# Altium project H750Common.PrjPCB
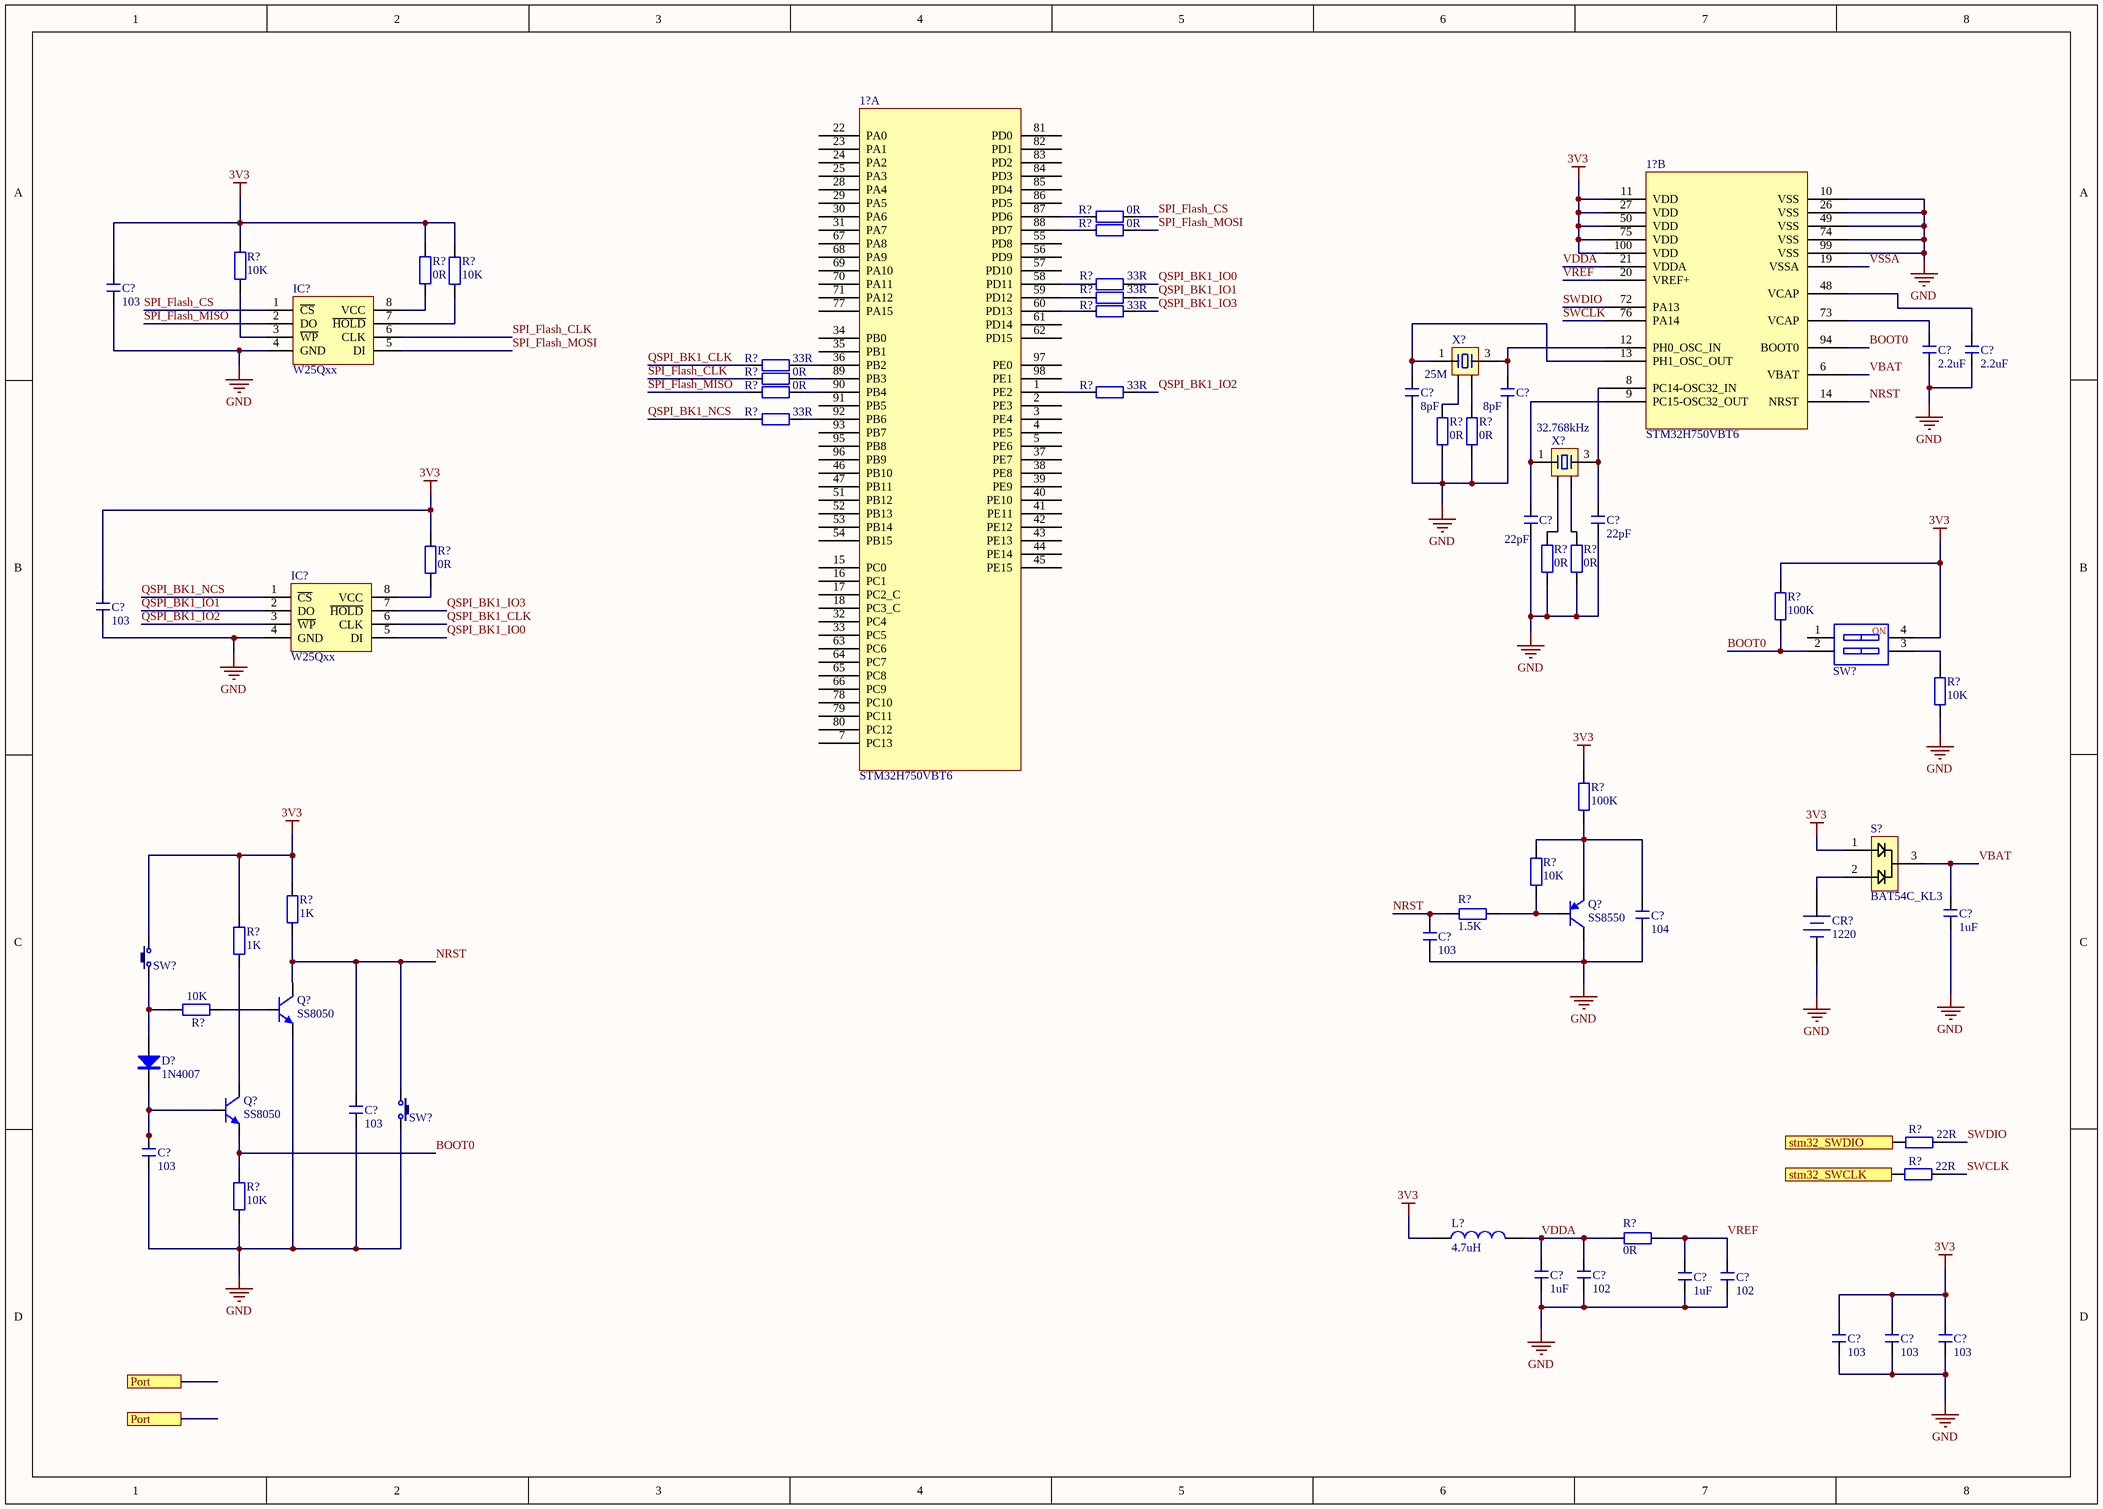
[diagram p0: H750Common2.SchDoc]
7 sheets, 143 parts. Net scope: flat (ports and power ports of the same name join across sheets).
Board file: H750Common.PcbDoc
Sheets:
  H750Common1.SchDoc
  H750Common2.SchDoc
  H750Common3.SchDoc
  H750Common4.SchDoc
  H750Common5.SchDoc
  H750Common6.SchDoc
  H750Common7.SchDoc

## Sheet H750Common1.SchDoc
size A3

## Sheet H750Common2.SchDoc
size A3

### Parts
(Parts that share a designator on the sheet are numbered #1, #2 ... from top to bottom, then left to right.)
1?#1  STM32H750VBT6  [F-QFP14x14-G100/P.5N]  (part B of 2)
1?#2  STM32H750VBT6  [F-QFP14x14-G100/P.5N]  (part A of 2)
C?#1  103  [C 0603_L]
C?#2  2.2uF  [C 0603_L]
C?#3  2.2uF  [C 0603_L]
C?#4  8pF  [C 0603_L]
C?#5  8pF  [C 0603_L]
C?#6  22pF  [C 0603_L]
C?#7  22pF  [C 0603_L]
C?#8  103  [C 0603_L]
C?#9  104  [C 0603_L]
C?#10  1uF  [C 0603_L]
C?#11  103  [C 0603_L]
C?#12  103  [C 0603_L]
C?#13  103  [C 0603_L]
C?#14  1uF  [C 0603_L]
C?#15  102  [C 0603_L]
C?#16  1uF  [C 0603_L]
C?#17  102  [C 0603_L]
C?#18  103  [C 0603_L]
C?#19  103  [C 0603_L]
C?#20  103  [C 0603_L]
CR?  1220  [CR1220_A]
D?  1N4007  [SMA]
IC?#1  W25Qxx  [SOP8W_N]
IC?#2  W25Qxx  [SOP8W_N]
L?#1  4.7uH  [L 0603]
Q?#1  SS8550  [SOT23-3N]
Q?#2  SS8050  [SOT23-3N]
Q?#3  SS8050  [SOT23-3N]
R?#1  0R  [R 0603_L]
R?#2  0R  [R 0603_L]
R?#3  10K  [R 0603_L]
R?#4  10K  [R 0603_L]
R?#5  33R  [R 0603_L]
R?#6  0R  [R 0603_L]
R?#7  33R  [R 0603_L]
R?#8  33R  [R 0603_L]
R?#9  33R  [R 0603_L]
R?#10  0R  [R 0603_L]
R?#11  0R  [R 0603_L]
R?#12  33R  [R 0603_L]
R?#13  33R  [R 0603_L]
R?#14  0R  [R 0603_L]
R?#15  0R  [R 0603_L]
R?#16  0R  [R 0603_L]
R?#17  0R  [R 0603_L]
R?#18  0R  [R 0603_L]
R?#19  100K  [R 0603_L]
R?#20  10K  [R 0603_L]
R?#21  100K  [R 0603_L]
R?#22  1K  [R 0603_L]
R?#23  10K  [R 0603_L]
R?#24  1K  [R 0603_L]
R?#25  1.5K  [R 0603_L]
R?#26  10K  [R 0603_L]
R?#27  22R  [R 0603_L]
R?#28  10K  [R 0603_L]
R?#29  22R  [R 0603_L]
R?#30  0R  [R 0603_L]
S?  BAT54C_KL3  [SO-G3/C2.25]
SW?#1  CSW-2P  [CSW1.27 SMD-2P]  (value not drawn)
SW?#2  3x6x5  [TSW SMD-3*6*2.5]  (value not drawn)
SW?#3  3x6x5  [TSW SMD-3*6*2.5]  (value not drawn)
X?#1  25M  [OSC 5032-4P]
X?#2  32.768kHz  [OSC 5032-4P]

### Ports
Port, stm32_SWCLK (in), stm32_SWDIO (in)

### Nets
3V3: 1?#1.11(VDD) 1?#1.27(VDD) 1?#1.50(VDD) 1?#1.75(VDD) 1?#1.100(VDD) C?#1.1 C?#8.1 C?#18.2 C?#19.2 C?#20.2 L?#1.1 R?#3.1 R?#4.1 R?#6.2 R?#16.2 R?#19.2 R?#21.2 R?#22.1 R?#24.1 S?.1 SW?#1.4 SW?#2.2
GND: 1?#1.10(VSS) 1?#1.26(VSS) 1?#1.49(VSS) 1?#1.74(VSS) 1?#1.99(VSS) C?#1.2 C?#2.1 C?#3.1 C?#4.1 C?#5.1 C?#6.1 C?#7.1 C?#8.2 C?#9.1 C?#10.1 C?#11.1 C?#12.1 C?#13.1 C?#14.1 C?#15.1 C?#16.1 C?#17.1 C?#18.1 C?#19.1 C?#20.1 CR?.2(DC-) IC?#1.4(GND) IC?#2.4(GND) Q?#1.3(C) Q?#2.2(E) R?#14.1 R?#15.1 R?#17.1 R?#18.1 R?#20.1 R?#28.2 SW?#3.2
BOOT0: 1?#1.94(BOOT0) Q?#3.2(E) R?#19.1 R?#28.1 SW?#1.2
NRST: 1?#1.14(NRST) C?#11.2 C?#12.2 Q?#2.3(C) R?#22.2 R?#25.2 SW?#3.1
QSPI_BK1_CLK: IC?#2.6(CLK) R?#9.2
QSPI_BK1_IO0: IC?#2.5(DI) R?#5.1
QSPI_BK1_IO1: IC?#2.2(DO) R?#7.1
QSPI_BK1_IO2: IC?#2.3(~{WP}) R?#12.1
QSPI_BK1_IO3: IC?#2.7(~{HOLD}) R?#8.1
QSPI_BK1_NCS: IC?#2.1(~{CS}) R?#13.2
SPI_Flash_CLK: IC?#1.6(CLK) R?#10.2
SPI_Flash_CS: IC?#1.1(~{CS}) R?#1.1
SPI_Flash_MISO: IC?#1.2(DO) R?#11.2
SPI_Flash_MOSI: IC?#1.5(DI) R?#2.1
SWCLK: 1?#1.76(PA14) R?#29.1
SWDIO: 1?#1.72(PA13) R?#27.1
VBAT: 1?#1.6(VBAT) C?#10.2 S?.3
VDDA: 1?#1.21(VDDA) C?#14.2 C?#15.2 L?#1.2 R?#30.1
VREF: 1?#1.20(VREF+) C?#16.2 C?#17.2 R?#30.2
VSSA: 1?#1.19(VSSA)
Net1?#1_8: 1?#1.8(PC14-OSC32_IN) C?#7.2 X?#2.3
Net1?#1_9: 1?#1.9(PC15-OSC32_OUT) C?#6.2 X?#2.1
Net1?#1_12: 1?#1.12(PH0_OSC_IN) C?#5.2 X?#1.3
Net1?#1_13: 1?#1.13(PH1_OSC_OUT) C?#4.2 X?#1.1
Net1?#1_48: 1?#1.48(VCAP) C?#3.2
Net1?#1_73: 1?#1.73(VCAP) C?#2.2
Net1?#2_1: 1?#2.1(PE2) R?#12.2
Net1?#2_36: 1?#2.36(PB2) R?#9.1
Net1?#2_58: 1?#2.58(PD11) R?#5.2
Net1?#2_59: 1?#2.59(PD12) R?#7.2
Net1?#2_60: 1?#2.60(PD13) R?#8.2
Net1?#2_87: 1?#2.87(PD6) R?#1.2
Net1?#2_88: 1?#2.88(PD7) R?#2.2
Net1?#2_89: 1?#2.89(PB3) R?#10.1
Net1?#2_90: 1?#2.90(PB4) R?#11.1
Net1?#2_92: 1?#2.92(PB6) R?#13.1
NetC?#9_2: C?#9.2 Q?#1.2(E) R?#21.1 R?#23.2
NetC?#13_2: C?#13.2 D?.2(K) Q?#3.1(B)
NetCR?_1: CR?.1(DC+) S?.2
NetD?_1: D?.1(A) R?#26.2 SW?#2.1
NetIC?#1_3: IC?#1.3(~{WP}) R?#3.2
NetIC?#1_7: IC?#1.7(~{HOLD}) R?#4.2
NetIC?#1_8: IC?#1.8(VCC) R?#6.1
NetIC?#2_8: IC?#2.8(VCC) R?#16.1
NetQ?#1_1: Q?#1.1(B) R?#23.1 R?#25.1
NetQ?#2_1: Q?#2.1(B) R?#26.1
NetQ?#3_3: Q?#3.3(C) R?#24.2
NetR?#14_2: R?#14.2 X?#1.2
NetR?#15_2: R?#15.2 X?#1.4
NetR?#17_2: R?#17.2 X?#2.2
NetR?#18_2: R?#18.2 X?#2.4
NetR?#20_2: R?#20.2 SW?#1.3
NetR?#27_2: R?#27.2 ; port stm32_SWDIO
NetR?#29_2: R?#29.2 ; port stm32_SWCLK

Not connected (* = marked no-connect by the designer): 1?#2 2(PE3) 3(PE4) 4(PE5) 5(PE6) 7(PC13) 15(PC0) 16(PC1) 17(PC2_C) 18(PC3_C) 22(PA0) 23(PA1) 24(PA2) 25(PA3) 28(PA4) 29(PA5) 30(PA6) 31(PA7) 32(PC4) 33(PC5) 34(PB0) 35(PB1) 37(PE7) 38(PE8) 39(PE9) 40(PE10) 41(PE11) 42(PE12) 43(PE13) 44(PE14) 45(PE15) 46(PB10) 47(PB11) 51(PB12) 52(PB13) 53(PB14) 54(PB15) 55(PD8) 56(PD9) 57(PD10) 61(PD14) 62(PD15) 63(PC6) 64(PC7) 65(PC8) 66(PC9) 67(PA8) 68(PA9) 69(PA10) 70(PA11) 71(PA12) 77(PA15) 78(PC10) 79(PC11) 80(PC12) 81(PD0) 82(PD1) 83(PD2) 84(PD3) 85(PD4) 86(PD5) 91(PB5) 93(PB7) 95(PB8) 96(PB9) 97(PE0) 98(PE1); SW?#1 1

### Notes on the sheet
- (in symbol CSW-2P) NO

### Library data of the parts
1?#1 1?#2 = STM32H750VB
C?#1-C?#20 = C: 无极性贴片电容; 版权归属: 源创客; BOM名称: 无极性贴片电容; 学习资源: www.ooocke.com
CR? = CR-3V: 微型电池; 版权归属: 源创客; BOM名称: 微型电池; 学习资源: www.ooocke.com
D? = 1N4007: 整流二极管; 版权归属: 源创客; BOM名称: 整流二极管; 学习资源: www.ooocke.com
IC?#1 IC?#2 = W25Qxx: 外置Flash; 版权归属: 源创客; BOM名称: 外置Flash; 学习资源: www.ooocke.com
L?#1 = L: 小功率贴片电感; 版权归属: 源创客; BOM名称: 小功率贴片电感; 学习资源: www.ooocke.com
Q?#1 = 8550-SMD: 高频放大-PNP型; 版权归属: 源创客; 属性: 40V 1.5A 1W 100MHZ; BOM名称: 高频放大-PNP型; 学习资源: www.ooocke.com
Q?#2 Q?#3 = 8050-SMD: 高频放大-NPN型; 版权归属: 源创客; 属性: 40V 1.5A 1W 100MHZ; BOM名称: 高频放大-NPN型; 学习资源: www.ooocke.com
R?#1-R?#30 = R: 贴片电阻; 版权归属: 源创客; BOM名称: 贴片电阻; 学习资源: www.ooocke.com
S? = BAT54C_KL3_1
SW?#1 = CSW-2P: 2路编码开关; 版权归属: 源创客; BOM名称: 2路编码开关; 学习资源: www.ooocke.com
SW?#2 SW?#3 = TSW 3x6: 3x6轻触开关; 版权归属: 源创客; BOM名称: 3x6轻触开关; 学习资源: www.ooocke.com
X?#1 X?#2 = XTAL-4P: 4脚无源晶振; 版权归属: 源创客; BOM名称: 4脚无源晶振; 学习资源: www.ooocke.com

## Sheet H750Common3.SchDoc
size A3
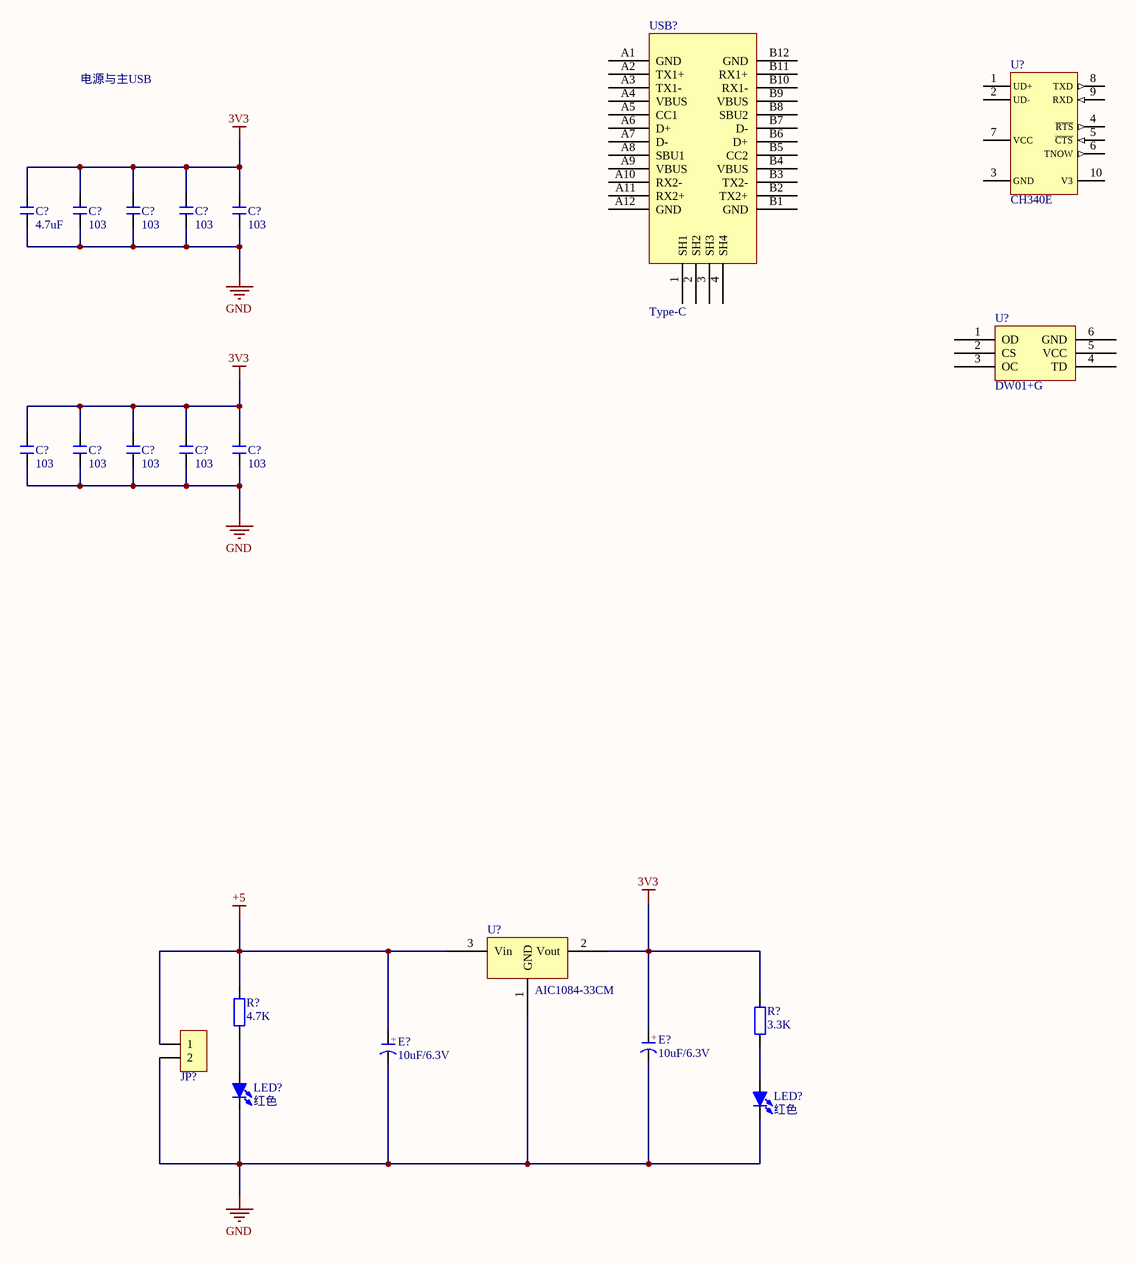
[diagram p1: H750Common3.SchDoc]

### Parts
(Parts that share a designator on the sheet are numbered #1, #2 ... from top to bottom, then left to right.)
C?#21  4.7uF  [C 0603_L]
C?#22  103  [C 0603_L]
C?#23  103  [C 0603_L]
C?#24  103  [C 0603_L]
C?#25  103  [C 0603_L]
C?#26  103  [C 0603_L]
C?#27  103  [C 0603_L]
C?#28  103  [C 0603_L]
C?#29  103  [C 0603_L]
C?#30  103  [C 0603_L]
E?#1  10uF/6.3V  [CD A(3216)]
E?#2  10uF/6.3V  [CD A(3216)]
JP?  HDR-1X2  [KF128-3.81-2P]  (value not drawn)
LED?#1  红色  [LED 0603R]
LED?#2  红色  [LED 0603B]
R?#31  4.7K  [R 0603_L]
R?#32  3.3K  [R 0603_L]
U?#1  CH340E  [MSOP-10]
U?#2  DW01+G  [SOT-23-6]
U?#3  AIC1084-33CM  [TO263-3B]
USB?#1  Type-C  [Type-C]

### Nets
3V3: C?#21.2 C?#22.2 C?#23.2 C?#24.2 C?#25.2 C?#26.2 C?#27.2 C?#28.2 C?#29.2 C?#30.2 E?#2.1(A) R?#32.1 U?#3.2(Vout)
+5: E?#1.1(A) JP?.1 R?#31.1 U?#3.3(Vin)
GND: C?#21.1 C?#22.1 C?#23.1 C?#24.1 C?#25.1 C?#26.1 C?#27.1 C?#28.1 C?#29.1 C?#30.1 E?#1.2(K) E?#2.2(K) JP?.2 LED?#1.2(K) LED?#2.2(K) U?#3.1(GND)
NetLED?#1_1: LED?#1.1(A) R?#31.2
NetLED?#2_1: LED?#2.1(A) R?#32.2

Not connected (* = marked no-connect by the designer): U?#1 1(UD+) 2(UD-) 3(GND) 4(~{RTS}) 5(~{CTS}) 6(TNOW) 7(VCC) 8(TXD) 9(RXD) 10(V3); U?#2 1(OD) 2(CS) 3(OC) 4(TD) 5(VCC) 6(GND); USB?#1 1(SH1) 2(SH2) 3(SH3) 4(SH4) A1(GND) A2(TX1+) A3(TX1-) A4(VBUS) A5(CC1) A6(D+) A7(D-) A8(SBU1) A9(VBUS) A10(RX2-) A11(RX2+) A12(GND) B1(GND) B2(TX2+) B3(TX2-) B4(VBUS) B5(CC2) B6(D+) B7(D-) B8(SBU2) B9(VBUS) B10(RX1-) B11(RX1+) B12(GND)

### Notes on the sheet
- 电源与主USB
- (in symbol C-CD) +

### Library data of the parts
C?#21-C?#30 = C: 无极性贴片电容; 版权归属: 源创客; BOM名称: 无极性贴片电容; 学习资源: www.ooocke.com
E?#1 E?#2 = C-CD: 贴片钽电容; 版权归属: 源创客; BOM名称: 贴片钽电容; 学习资源: www.ooocke.com
JP? = Header 2: 2P接插件; 版权归属: 源创客; BOM名称: 2P接插件; 学习资源: www.ooocke.com
LED?#1 LED?#2 = LED-SMD: 贴片LED; 版权归属: 源创客; BOM名称: 贴片LED; 学习资源: www.ooocke.com
R?#31 R?#32 = R: 贴片电阻; 版权归属: 源创客; BOM名称: 贴片电阻; 学习资源: www.ooocke.com
U?#1 = CH340E: USB 转 串口
U?#2 = DW01+G_[C14213]: 电池保护芯片; ComponentLink1Description: 供应商链接; ComponentLink1URL: http://www.szlcsc.com/product/details_14870.html; Package: SOT-23-6; Supplier: LC; SuppliersPartNumber: C14213
U?#3 = AIC1084-33CM: pin to pad: 1>G 2>D 3>S

## Sheet H750Common4.SchDoc
size A3
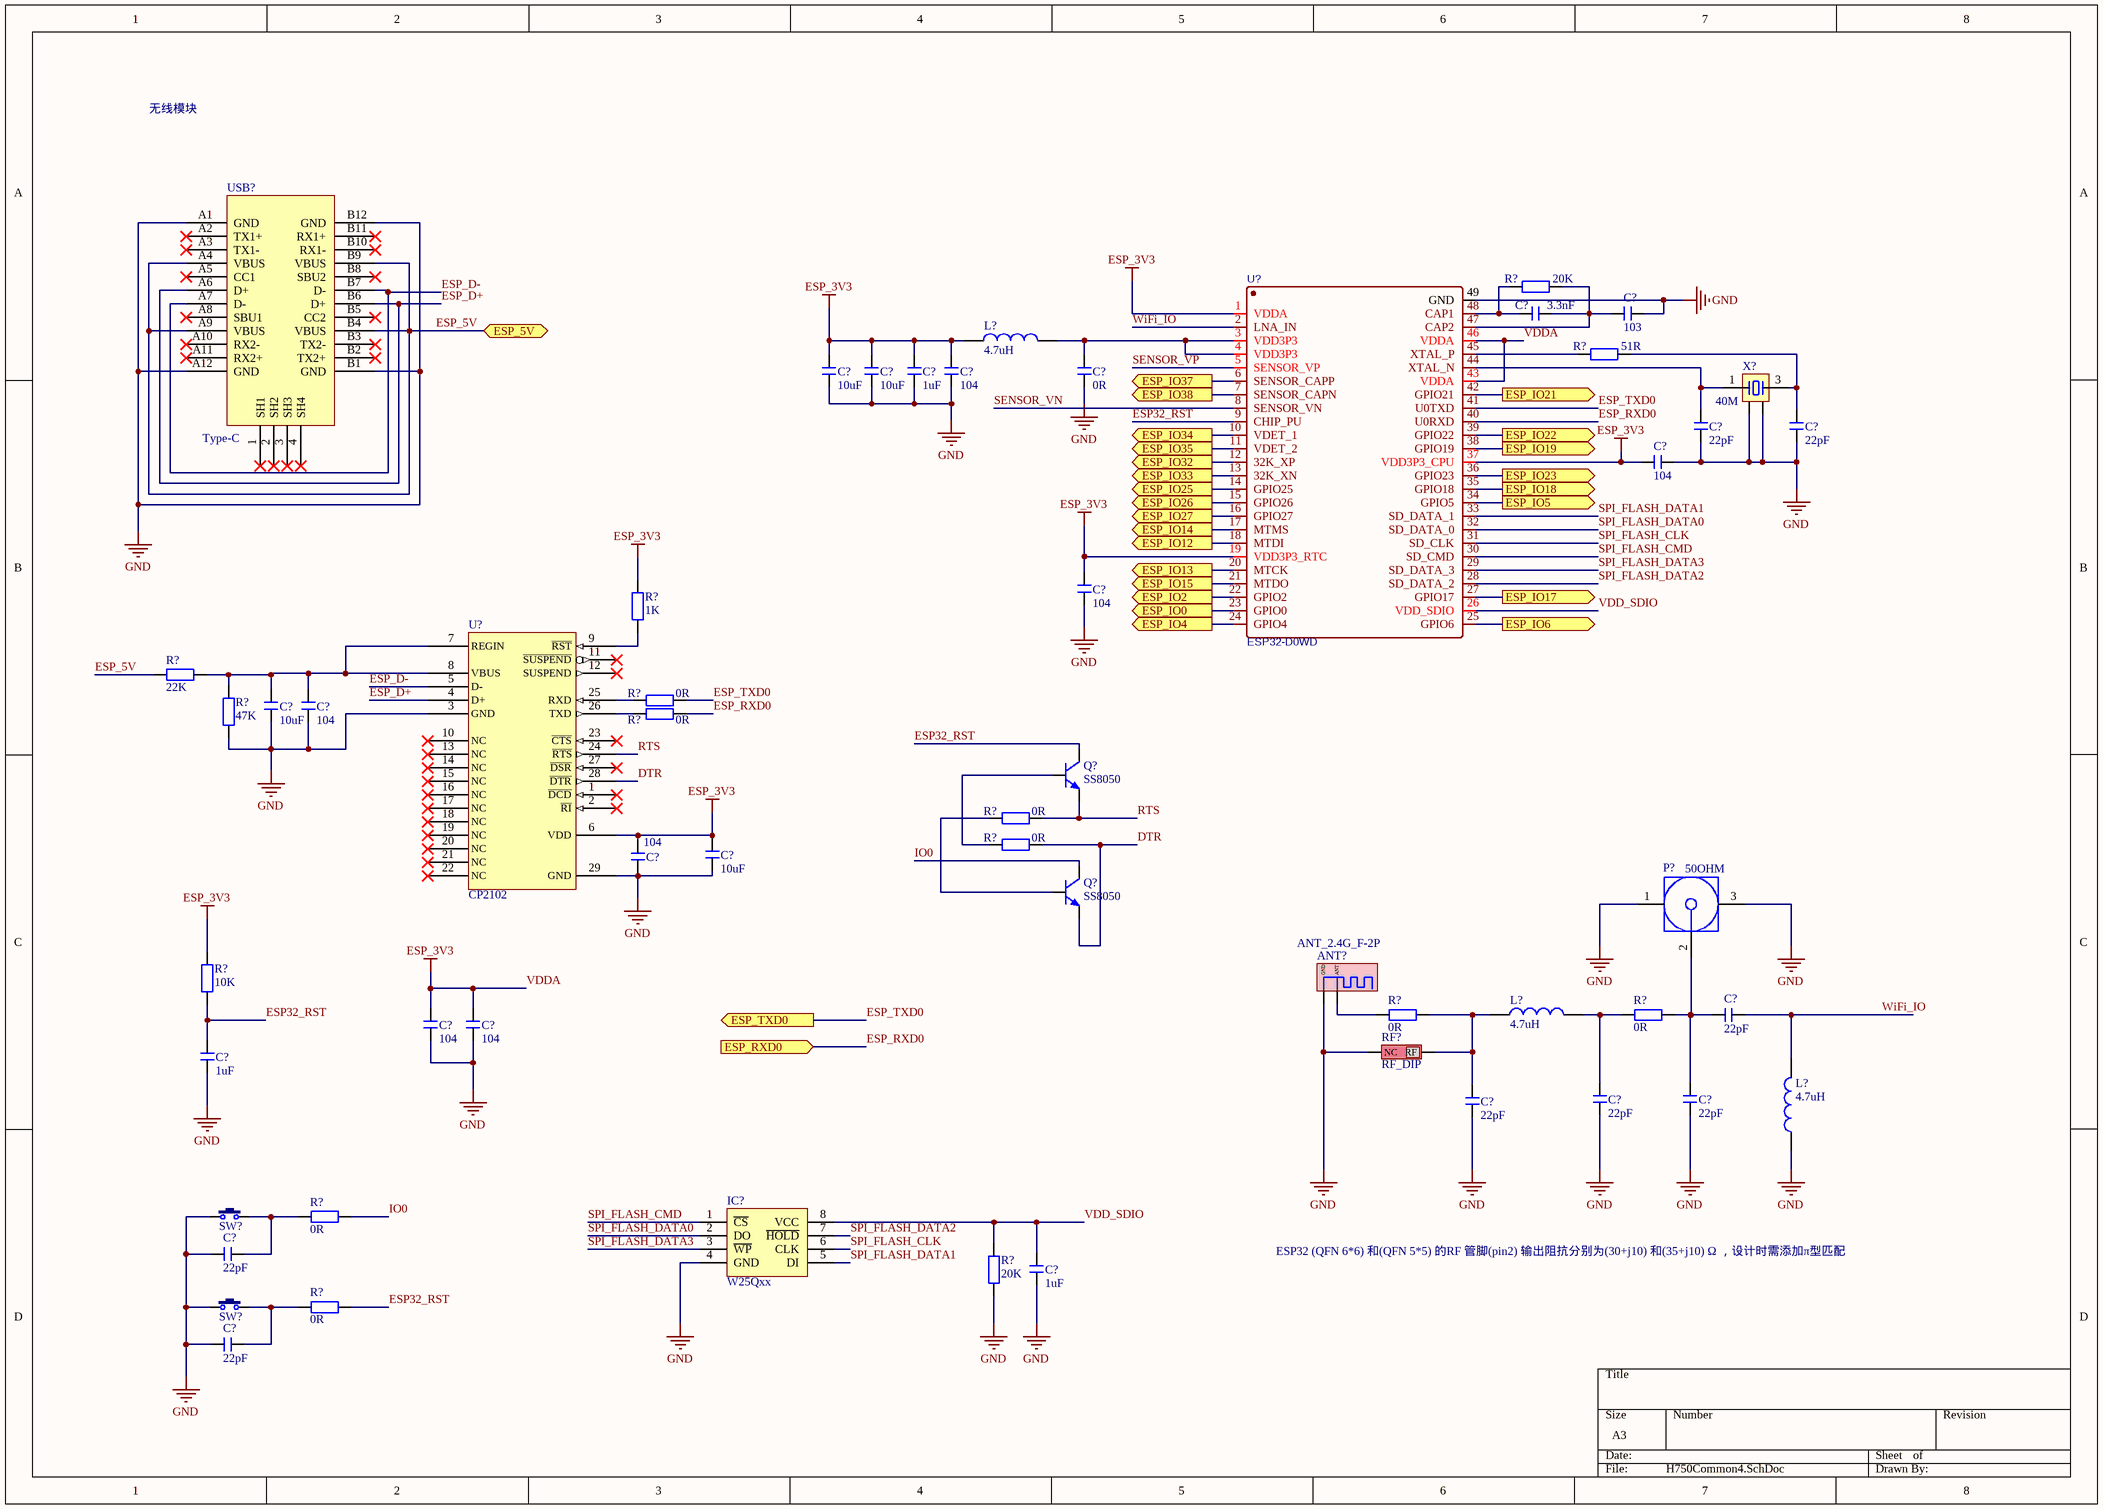
[diagram p2: H750Common4.SchDoc]

### Parts
(Parts that share a designator on the sheet are numbered #1, #2 ... from top to bottom, then left to right.)
ANT?  ANT_2.4G_F-2P  [ANT_2.4G_F-2P-1]
C?#31  3.3nF  [C 0603_L]
C?#32  103  [C 0603_L]
C?#33  10uF  [C 0603_L]
C?#34  10uF  [C 0603_L]
C?#35  1uF  [C 0603_L]
C?#36  104  [C 0603_L]
C?#37  0R  [C 0603_L]
C?#38  22pF  [C 0603_L]
C?#39  22pF  [C 0603_L]
C?#40  104  [C 0603_L]
C?#41  104  [C 0603_L]
C?#42  10uF  [C 0603_L]
C?#43  104  [C 0603_L]
C?#44  10uF  [C 0603_L]
C?#45  104  [C 0603_L]
C?#46  104  [C 0603_L]
C?#47  104  [C 0603_L]
C?#48  22pF  [C 0603_L]
C?#49  1uF  [C 0603_L]
C?#50  22pF  [C 0603_L]
C?#51  22pF  [C 0603_L]
C?#52  22pF  [C 0603_L]
C?#53  22pF  [C 0603_L]
C?#54  1uF  [C 0603_L]
C?#55  22pF  [C 0603_L]
IC?#3  W25Qxx  [SOP8W_N]
L?#2  4.7uH  [L 0603]
L?#3  4.7uH  [L 0603]
L?#4  4.7uH  [L 0603]
P?  50OHM  [IPEX]
Q?#4  SS8050  [SOT23-3N]
Q?#5  SS8050  [SOT23-3N]
R?#33  20K  [R 0603_L]
R?#34  51R  [R 0603_L]
R?#35  1K  [R 0603_L]
R?#36  22K  [R 0603_L]
R?#37  47K  [R 0603_L]
R?#38  0R  [R 0603_L]
R?#39  0R  [R 0603_L]
R?#40  0R  [R 0603_L]
R?#41  0R  [R 0603_L]
R?#42  10K  [R 0603_L]
R?#43  0R  [R 0603_L]
R?#44  0R  [R 0603_L]
R?#45  0R  [R 0603_L]
R?#46  20K  [R 0603_L]
R?#47  0R  [R 0603_L]
RF?  RF_DIP  [ANT_LA31H2450-A35]
SW?#4  3x6x5  [TSW SMD-3*6*2.5]  (value not drawn)
SW?#5  3x6x5  [TSW SMD-3*6*2.5]  (value not drawn)
U?#4  ESP32-D0WD  [ESP32-D0WD]
U?#5  CP2102  [CP2102-N]
USB?#2  Type-C  [Type-C]
X?#3  40M  [OSC 5032-4P]

### Ports
ESP_5V (bidir), ESP_IO0 (out), ESP_IO2 (out), ESP_IO4 (out), ESP_IO5 (out), ESP_IO6 (out), ESP_IO12 (out), ESP_IO13 (out), ESP_IO14 (out), ESP_IO15 (out), ESP_IO17 (out), ESP_IO18 (out), ESP_IO19 (out), ESP_IO21 (out), ESP_IO22 (out), ESP_IO23 (out), ESP_IO25 (out), ESP_IO26 (out), ESP_IO27 (out), ESP_IO32 (out), ESP_IO33 (out), ESP_IO34 (out), ESP_IO35 (out), ESP_IO37 (out), ESP_IO38 (out), ESP_RXD0 (in), ESP_TXD0 (out)

### Nets
GND: ANT?.2(GND) C?#32.1 C?#33.1 C?#34.1 C?#35.1 C?#36.1 C?#37.1 C?#38.1 C?#39.1 C?#40.1 C?#41.1 C?#42.1 C?#43.1 C?#44.1 C?#45.1 C?#46.2 C?#47.2 C?#49.1 C?#50.2 C?#51.2 C?#52.2 C?#53.2 C?#54.1 C?#55.2 IC?#3.4(GND) L?#4.1 P?.1 P?.3 R?#37.2 R?#46.2 RF?.2(NC) SW?#4.1 SW?#5.1 U?#4.49(GND) U?#5.3(GND) U?#5.29(GND) USB?#2.A1(GND) USB?#2.A12(GND) USB?#2.B1(GND) USB?#2.B12(GND) X?#3.2 X?#3.4
VDDA: C?#33.2 C?#34.2 C?#35.2 C?#36.2 C?#40.2 C?#41.2 C?#44.2 C?#45.2 C?#46.1 C?#47.1 L?#2.1 R?#35.1 R?#42.1 U?#4.1(VDDA) U?#4.19(VDD3P3_RTC) U?#4.37(VDD3P3_CPU) U?#4.43(VDDA) U?#4.46(VDDA) U?#5.6(VDD)  [also labelled ESP_3V3]
DTR: Q?#5.2(E) R?#41.2 U?#5.28(~{DTR})
ESP32_RST: C?#49.2 Q?#4.3(C) R?#42.2 R?#47.1 U?#4.9(CHIP_PU)
ESP_5V: R?#36.1 USB?#2.A4(VBUS) USB?#2.A9(VBUS) USB?#2.B4(VBUS) USB?#2.B9(VBUS) ; port ESP_5V
ESP_D+: U?#5.4(D+) USB?#2.A6(D+) USB?#2.B6(D+)
ESP_D-: U?#5.5(D-) USB?#2.A7(D-) USB?#2.B7(D-)
ESP_RXD0: R?#39.2 U?#4.40(U0RXD) ; port ESP_RXD0
ESP_TXD0: R?#38.2 U?#4.41(U0TXD) ; port ESP_TXD0
IO0: Q?#5.3(C) R?#45.1
RTS: Q?#4.2(E) R?#40.2 U?#5.24(~{RTS})
SENSOR_VN: U?#4.8(SENSOR_VN)
SENSOR_VP: U?#4.5(SENSOR_VP)
SPI_FLASH_CLK: IC?#3.6(CLK) U?#4.31(SD_CLK)
SPI_FLASH_CMD: IC?#3.1(~{CS}) U?#4.30(SD_CMD)
SPI_FLASH_DATA0: IC?#3.2(DO) U?#4.32(SD_DATA_0)
SPI_FLASH_DATA1: IC?#3.5(DI) U?#4.33(SD_DATA_1)
SPI_FLASH_DATA2: IC?#3.7(~{HOLD}) U?#4.28(SD_DATA_2)
SPI_FLASH_DATA3: IC?#3.3(~{WP}) U?#4.29(SD_DATA_3)
VDD_SDIO: C?#54.2 IC?#3.8(VCC) R?#46.1 U?#4.26(VDD_SDIO)
WiFi_IO: C?#48.1 L?#4.2 U?#4.2(LNA_IN)
NetANT?_1: ANT?.1(ANT) R?#43.2
NetC?#31_1: C?#31.1 C?#32.2 R?#33.1 U?#4.47(CAP2)
NetC?#31_2: C?#31.2 R?#33.2 U?#4.48(CAP1)
NetC?#37_2: C?#37.2 L?#2.2 U?#4.3(VDD3P3) U?#4.4(VDD3P3)
NetC?#38_2: C?#38.2 U?#4.44(XTAL_N) X?#3.1
NetC?#39_2: C?#39.2 R?#34.1 X?#3.3
NetC?#42_2: C?#42.2 C?#43.2 R?#36.2 R?#37.1 U?#5.7(REGIN) U?#5.8(VBUS)
NetC?#48_2: C?#48.2 C?#52.1 P?.2 R?#44.1
NetC?#50_1: C?#50.1 L?#3.1 R?#43.1 RF?.1(RF)
NetC?#51_1: C?#51.1 L?#3.2 R?#44.2
NetC?#53_1: C?#53.1 R?#45.2 SW?#4.2
NetC?#55_1: C?#55.1 R?#47.2 SW?#5.2
NetQ?#4_1: Q?#4.1(B) R?#41.1
NetQ?#5_1: Q?#5.1(B) R?#40.1
NetR?#34_2: R?#34.2 U?#4.45(XTAL_P)
NetR?#35_2: R?#35.2 U?#5.9(~{RST})
NetR?#38_1: R?#38.1 U?#5.25(RXD)
NetR?#39_1: R?#39.1 U?#5.26(TXD)
NetU?#4_6: U?#4.6(SENSOR_CAPP) ; port ESP_IO37
NetU?#4_7: U?#4.7(SENSOR_CAPN) ; port ESP_IO38
NetU?#4_10: U?#4.10(VDET_1) ; port ESP_IO34
NetU?#4_11: U?#4.11(VDET_2) ; port ESP_IO35
NetU?#4_12: U?#4.12(32K_XP) ; port ESP_IO32
NetU?#4_13: U?#4.13(32K_XN) ; port ESP_IO33
NetU?#4_14: U?#4.14(GPIO25) ; port ESP_IO25
NetU?#4_15: U?#4.15(GPIO26) ; port ESP_IO26
NetU?#4_16: U?#4.16(GPIO27) ; port ESP_IO27
NetU?#4_17: U?#4.17(MTMS) ; port ESP_IO14
NetU?#4_18: U?#4.18(MTDI) ; port ESP_IO12
NetU?#4_20: U?#4.20(MTCK) ; port ESP_IO13
NetU?#4_21: U?#4.21(MTDO) ; port ESP_IO15
NetU?#4_22: U?#4.22(GPIO2) ; port ESP_IO2
NetU?#4_23: U?#4.23(GPIO0) ; port ESP_IO0
NetU?#4_24: U?#4.24(GPIO4) ; port ESP_IO4
NetU?#4_25: U?#4.25(GPIO6) ; port ESP_IO6
NetU?#4_27: U?#4.27(GPIO17) ; port ESP_IO17
NetU?#4_34: U?#4.34(GPIO5) ; port ESP_IO5
NetU?#4_35: U?#4.35(GPIO18) ; port ESP_IO18
NetU?#4_36: U?#4.36(GPIO23) ; port ESP_IO23
NetU?#4_38: U?#4.38(GPIO19) ; port ESP_IO19
NetU?#4_39: U?#4.39(GPIO22) ; port ESP_IO22
NetU?#4_42: U?#4.42(GPIO21) ; port ESP_IO21

Not connected (* = marked no-connect by the designer): U?#5 1(~{DCD})* 2(~{RI})* 10(NC)* 11(~{SUSPEND})* 12(SUSPEND)* 13(NC)* 14(NC)* 15(NC)* 16(NC)* 17(NC)* 18(NC)* 19(NC)* 20(NC)* 21(NC)* 22(NC)* 23(~{CTS})* 27(~{DSR})*; USB?#2 1(SH1)* 2(SH2)* 3(SH3)* 4(SH4)* A2(TX1+)* A3(TX1-)* A5(CC1)* A8(SBU1)* A10(RX2-)* A11(RX2+)* B2(TX2+)* B3(TX2-)* B5(CC2)* B8(SBU2)* B10(RX1-)* B11(RX1+)*

### Notes on the sheet
- 无线模块
- ESP32 (QFN 6*6) 和(QFN 5*5) 的RF 管脚(pin2) 输出阻抗分别为(30+j10) 和(35+j10) Ω ，设计时需添加π型匹配

### Library data of the parts
ANT? = ANT_2.4G_F-2P: PCB天线(F-2P),2.4G; 频率: 2.4G
C?#31-C?#55 = C: 无极性贴片电容; 版权归属: 源创客; BOM名称: 无极性贴片电容; 学习资源: www.ooocke.com
IC?#3 = W25Qxx: 外置Flash; 版权归属: 源创客; BOM名称: 外置Flash; 学习资源: www.ooocke.com
L?#2-L?#4 = L: 小功率贴片电感; 版权归属: 源创客; BOM名称: 小功率贴片电感; 学习资源: www.ooocke.com
P? = IPEX: RF Coaxial PCB Connector, MCX; Thru-Hole, Right-Angle Mount Socket, Blunt Post Terminal, 50 Ohm Impedance; PCB_Layout: Complies with manufacturer's recommendation.; DrillSize: Corresponds to nominal value.; Published: 15-Jul-2004; LatestRevisionDate: 15-Jul-2004; LatestRevisionNote: Component Replaced.; DatasheetDocument: 30-May-2003; PackageDocument: 04-Jul-1999; PackageReference: 919-119J-51AX; Publisher: Altium Limited; ComponentLink1Description: Manufacturer Link; ComponentLink1URL: http://www.amphenolrf.com/
Q?#4 Q?#5 = 8050-SMD: as Q?#2 on sheet H750Common2; BOM名称: 高频放大-NPN型; 学习资源: www.ooocke.com
R?#33-R?#47 = R: 贴片电阻; 版权归属: 源创客; BOM名称: 贴片电阻; 学习资源: www.ooocke.com
RF? = ANT_3216_LA31H2450-A35: 陶瓷天线,2.4G
SW?#4 SW?#5 = TSW 3x6: 3x6轻触开关; 版权归属: 源创客; BOM名称: 3x6轻触开关; 学习资源: www.ooocke.com
U?#4 = ESP32-D0WD: BOM_Manufacturer: ESPRESSIF 乐鑫; Contributor: LCSC; BOM_Supplier: LCSC; BOM_Supplier Part: C130167; BOM_Manufacturer Part: ESP32-D0WD; BOM_JLCPCB Part Class: Extended Part; spicePre: U; spiceSymbolName: ESP32-D0WD
U?#5 = CP2102: USB 转 串口-MAX: 1Mbps
X?#3 = XTAL-4P: 4脚无源晶振; 版权归属: 源创客; BOM名称: 4脚无源晶振; 学习资源: www.ooocke.com

## Sheet H750Common5.SchDoc
size A3
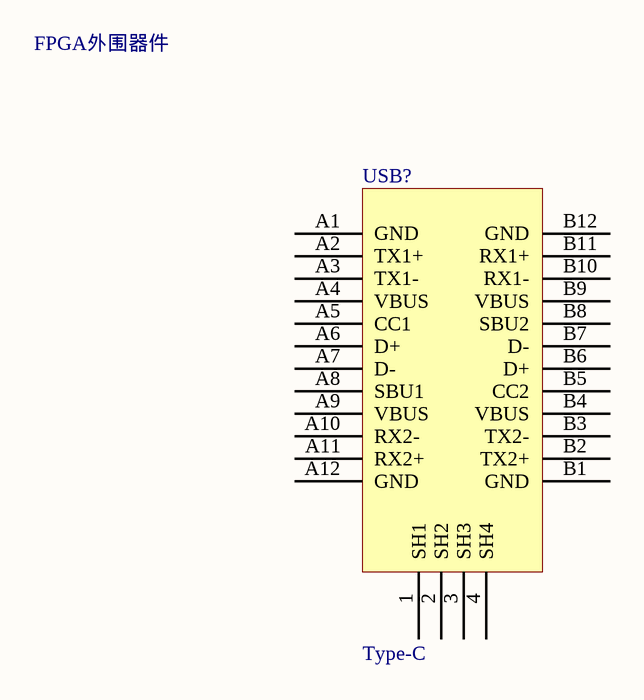
[diagram p3: H750Common5.SchDoc]

### Parts
(Parts that share a designator on the sheet are numbered #1, #2 ... from top to bottom, then left to right.)
USB?#3  Type-C  [Type-C]

### Nets

Not connected (* = marked no-connect by the designer): USB?#3 1(SH1) 2(SH2) 3(SH3) 4(SH4) A1(GND) A2(TX1+) A3(TX1-) A4(VBUS) A5(CC1) A6(D+) A7(D-) A8(SBU1) A9(VBUS) A10(RX2-) A11(RX2+) A12(GND) B1(GND) B2(TX2+) B3(TX2-) B4(VBUS) B5(CC2) B6(D+) B7(D-) B8(SBU2) B9(VBUS) B10(RX1-) B11(RX1+) B12(GND)

### Notes on the sheet
- FPGA外围器件

## Sheet H750Common6.SchDoc
size A3
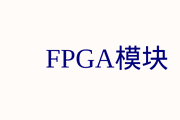
[diagram p4: H750Common6.SchDoc]

### Notes on the sheet
- FPGA模块

## Sheet H750Common7.SchDoc
size A3
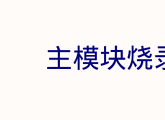
[diagram p5: H750Common7.SchDoc]

### Notes on the sheet
- 主模块烧录

## Nets that join several sheets
3V3: H750Common2 (22 pins), H750Common3 (13 pins)
GND: H750Common2 (37 pins), H750Common3 (16 pins), H750Common4 (42 pins)